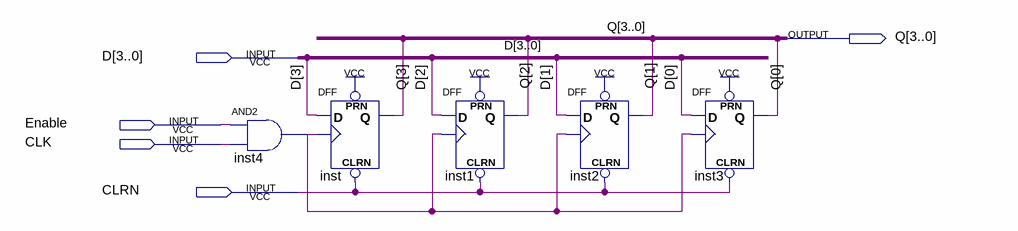
[diagram p0: schematic sheet]
// Quartus schematic REGISTER_PIPO_4BITS.bdf as structural Verilog: 5 symbols, 5 pins
module REGISTER_PIPO_4BITS (
  input  [3:0] D,
  input  Enable,
  input  CLK,
  input  CLRN,
  output [3:0] Q
);

  wire inst4_out;

  and inst4 (inst4_out, Enable, CLK);
  DFF inst (.CLRN(CLRN), .CLK(inst4_out), .D(D[3]), .PRN(1'b1), .Q(Q[3]));
  DFF inst1 (.CLRN(CLRN), .CLK(inst4_out), .D(D[2]), .PRN(1'b1), .Q(Q[2]));
  DFF inst2 (.CLRN(CLRN), .CLK(inst4_out), .D(D[1]), .PRN(1'b1), .Q(Q[1]));
  DFF inst3 (.CLRN(CLRN), .CLK(inst4_out), .D(D[0]), .PRN(1'b1), .Q(Q[0]));
endmodule
